# Altium schematic sheet GPIO-I2C.SchDoc: =ProjectTitle
size 297 x 209 mm; Address1: Address1; Address2: Address2; Address3: Address3; Address4: Address4; SheetNumber: 5; SheetTotal: 16; Scale: 1:1; DocumentType: Схема электрическая принципиальная
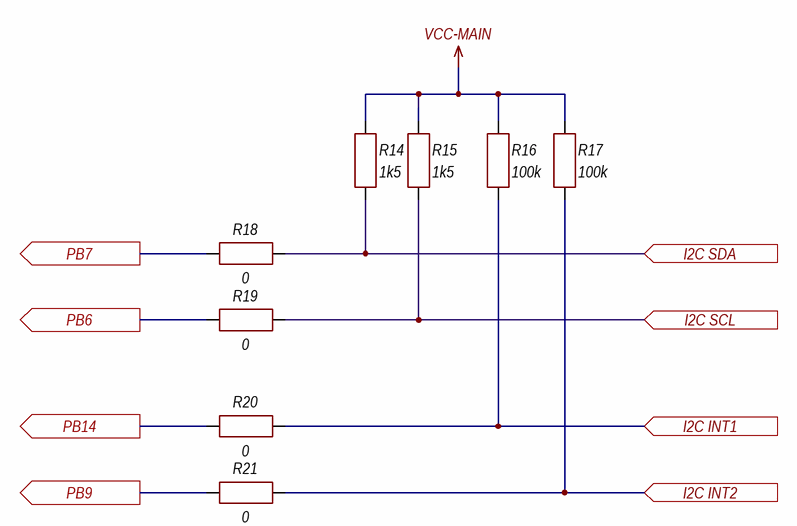
[diagram p0: GPIO-I2C.SchDoc]

## Parts
R14  1k5  [CH0402R]
R15  1k5  [CH0402R]
R16  100k  [CH0402R]
R17  100k  [CH0402R]
R18  0  [CH0402R]
R19  0  [CH0402R]
R20  0  [CH0402R]
R21  0  [CH0402R]

## Ports
I2C INT1 (in), I2C INT2 (in), I2C SCL (in), I2C SDA (in), PB6 (out), PB7 (out), PB9 (out), PB14 (out)

## Nets
VCC-MAIN: R14.2 R15.2 R16.2 R17.2
I2C INT1: R16.1 R20.2 ; port I2C INT1
I2C INT2: R17.1 R21.2 ; port I2C INT2
I2C SCL: R15.1 R19.2 ; port I2C SCL
I2C SDA: R14.1 R18.2 ; port I2C SDA
PB6: R19.1 ; port PB6
PB7: R18.1 ; port PB7
PB9: R21.1 ; port PB9
PB14: R20.1 ; port PB14

## Notes on the sheet
- Изм.
- Лист
- № докум.
- Подп.
- Дата
- Копировал
- Формат А4

## Library data of the parts
R14-R21 = Resistor: Manufacturer: *; Model: *; HelpURL: *; ComponentKind: *
  R14 R15: Value: 1k5
  R16 R17: Value: 100k
  R18-R21: Value: 0